# Altium project MaketeEAS.PrjPcb
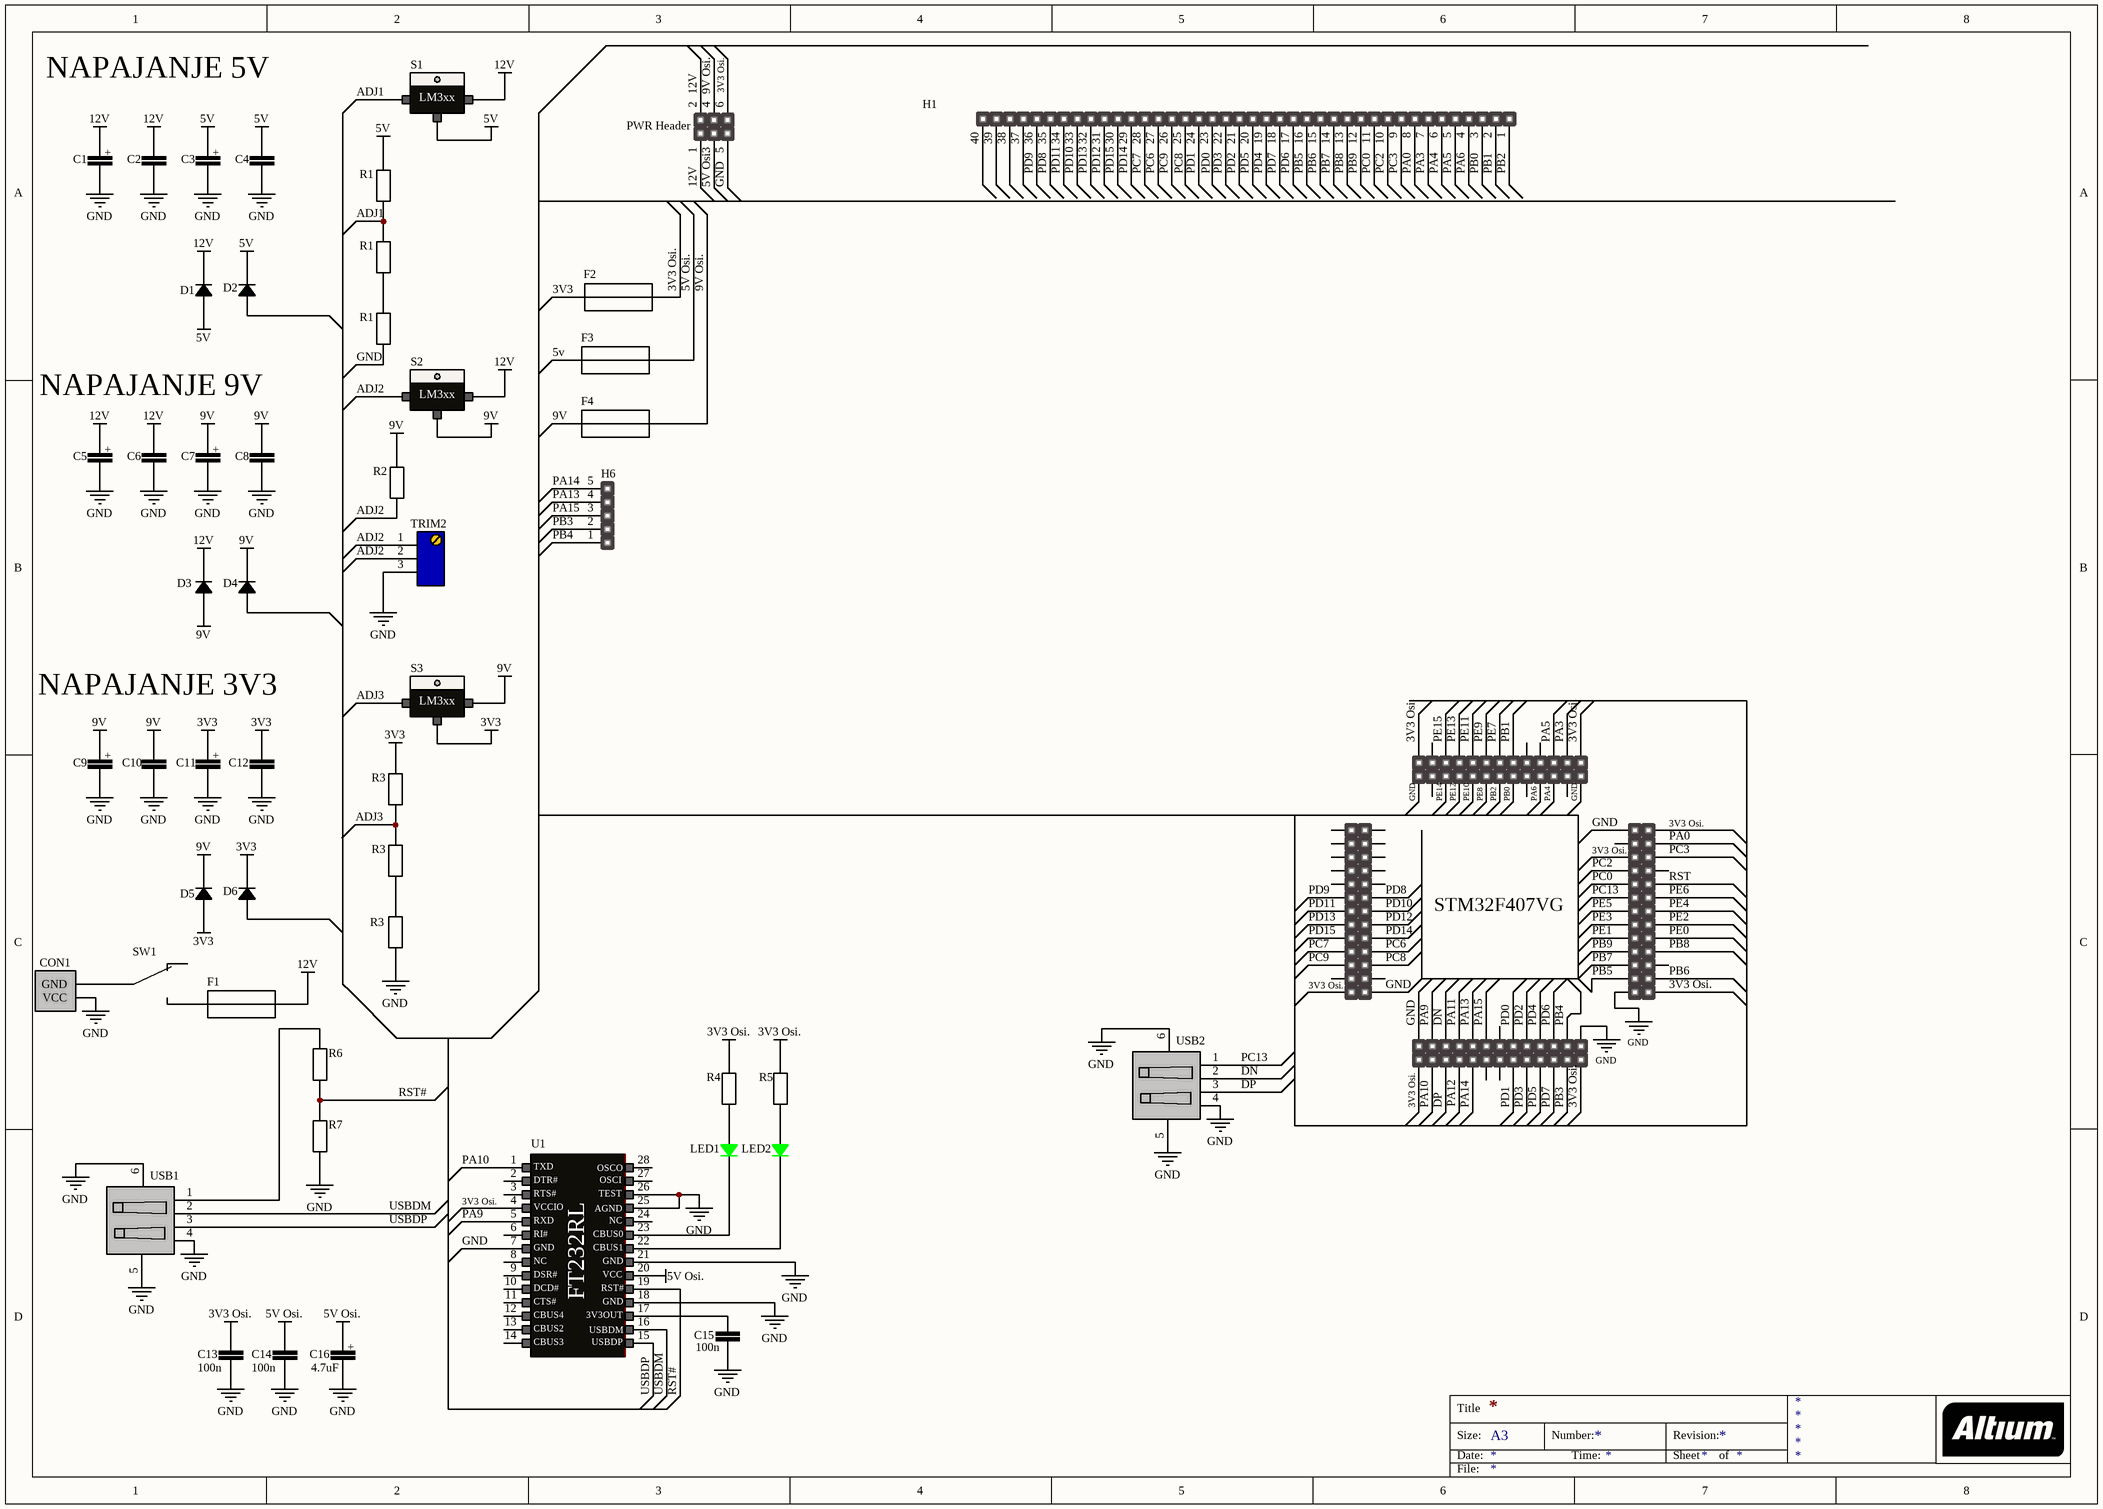
[diagram p0: Sheet1.SchDoc]
2 sheets, 119 parts. Net scope: global (net labels, ports and power ports of the same name join across sheets).
Sheets:
  Sheet1.SchDoc
  Sheet2.SchDoc

## Sheet Sheet1.SchDoc
size A3

### Parts
(Parts that share a designator on the sheet are numbered #1, #2 ... from top to bottom, then left to right.)
C1  (no value)
C2  (no value)  [C1(150milsa)]
C3  (no value)
C4  (no value)  [C1(150milsa)]
C5  (no value)
C6  (no value)  [C1(150milsa)]
C7  (no value)
C8  (no value)  [C1(150milsa)]
C9  (no value)
C10  (no value)  [C1(150milsa)]
C11  (no value)
C12  (no value)  [C1(150milsa)]
C13  100n  [C1(150milsa)]
C14  100n  [C1(150milsa)]
C15  100n  [C1(150milsa)]
C16  4.7uF  [C2(elektrolit)]
CON1  (no value)
D1  (no value)  [D1(300milsa)]
D2  (no value)  [D1(300milsa)]
D3  (no value)  [D1(300milsa)]
D4  (no value)  [D1(300milsa)]
D5  (no value)  [D1(300milsa)]
D6  (no value)  [D1(300milsa)]
F1  (no value)
F2  (no value)
F3  (no value)
F4  (no value)
H1#1  (no value)
H6  (no value)
LED1#1  (no value)  [LED(3mm)]
LED2#1  (no value)  [LED(3mm)]
PWR_Header  (no value)
R1#1  (no value)  [R1(200milsa)]
R1#2  (no value)  [R1(200milsa)]
R1#3  (no value)  [R1(200milsa)]
R2#1  (no value)  [R1(200milsa)]
R3#1  (no value)  [R1(200milsa)]
R3#2  (no value)  [R1(200milsa)]
R3#3  (no value)  [R1(200milsa)]
R4#1  (no value)  [R1(200milsa)]
R5#1  (no value)  [R1(200milsa)]
R6#1  (no value)  [R1(200milsa)]
R7#1  (no value)  [R1(200milsa)]
S1  (no value)  [TO220]
S2  (no value)  [TO220]
S3  (no value)  [TO220]
STM32F407VG  (no value)  [STM32F407VG(ethernet)]
SW1#1  (no value)
TRIM2  (no value)
U1  (no value)  [FT232RL]
USB1  (no value)
USB2  (no value)

### Nets
3V3: C11.1 C12.2 D5.1 D6.2 F2.1 S3.2
3V3 Osi.: C13.1 F2.2 PWR_Header.6 R4#1.2 R5#1.2 STM32F407VG.25 STM32F407VG.27 STM32F407VG.51 STM32F407VG.53 STM32F407VG.74 STM32F407VG.77 STM32F407VG.79 STM32F407VG.103 U1.4
5v: C3.1 C4.2 D1.1 D2.2 F3.1 R1#1.2 S1.2
5V Osi.: C14.1 C16.1 F3.2 PWR_Header.3 U1.20
9V: C7.1 C8.2 C9.1 C10.2 D3.1 D4.2 D5.2 F4.1 R2#1.2 S2.2 S3.3
12V: C1.1 C2.2 C5.1 C6.2 D1.2 D3.2 F1.2 PWR_Header.1 PWR_Header.2 S1.3 S2.3
GND: C1.2 C2.1 C3.2 C4.1 C5.2 C6.1 C7.2 C8.1 C9.2 C10.1 C11.2 C12.1 C13.2 C14.2 C15.2 C16.2 CON1.1(VCC) PWR_Header.5 R1#3.1 R3#3.2 R7#1.2 STM32F407VG.26 STM32F407VG.28 STM32F407VG.52 STM32F407VG.54 STM32F407VG.78 STM32F407VG.80 STM32F407VG.104 TRIM2.3 U1.7 U1.18 U1.21 U1.25 U1.26 USB1.4 USB1.5 USB1.6 USB2.4 USB2.5 USB2.6
9V Osi.: F4.2 PWR_Header.4
ADJ1: R1#1.1 R1#2.2 S1.1
ADJ2: R2#1.1 S2.1 TRIM2.1 TRIM2.2
ADJ3: R3#1.1 R3#2.2 S3.1
DN: STM32F407VG.32 USB2.2
DP: STM32F407VG.31 USB2.3
PA0: H1#1.8 STM32F407VG.75
PA3: H1#1.7 STM32F407VG.81
PA4: H1#1.6 STM32F407VG.84
PA5: H1#1.5 STM32F407VG.83
PA6: H1#1.4 STM32F407VG.86
PA9: STM32F407VG.30 U1.5
PA10: STM32F407VG.29 U1.1
PA11: STM32F407VG.34
PA12: STM32F407VG.33
PA13: H6.4 STM32F407VG.36
PA14: H6.5 STM32F407VG.35
PA15: H6.3 STM32F407VG.38
PB0: H1#1.3 STM32F407VG.90
PB1: H1#1.2 STM32F407VG.89
PB2: H1#1.1 STM32F407VG.92
PB3: H6.2 STM32F407VG.49
PB4: H6.1 STM32F407VG.50
PB5: H1#1.16 STM32F407VG.56
PB6: H1#1.15 STM32F407VG.55
PB7: H1#1.14 STM32F407VG.58
PB8: H1#1.13 STM32F407VG.59
PB9: H1#1.12 STM32F407VG.60
PC0: H1#1.11 STM32F407VG.70
PC2: H1#1.10 STM32F407VG.72
PC3: H1#1.9 STM32F407VG.73
PC6: H1#1.27 STM32F407VG.20
PC7: H1#1.28 STM32F407VG.19
PC8: STM32F407VG.22
PC9: H1#1.26 STM32F407VG.21
PC13: STM32F407VG.68 USB2.1
PD0: STM32F407VG.42
PD1: H1#1.24 STM32F407VG.41
PD2: H1#1.21 STM32F407VG.44
PD3: H1#1.22 STM32F407VG.43
PD4: H1#1.19 STM32F407VG.46
PD5: H1#1.20 STM32F407VG.45
PD6: H1#1.17 STM32F407VG.48
PD7: H1#1.18 STM32F407VG.47
PD8: H1#1.35 STM32F407VG.12
PD9: H1#1.36 STM32F407VG.11
PD10: H1#1.33 STM32F407VG.14
PD11: H1#1.34 STM32F407VG.13
PD12: H1#1.31 STM32F407VG.16
PD13: H1#1.32 STM32F407VG.15
PD14: H1#1.29 STM32F407VG.18
PD15: H1#1.30 STM32F407VG.17
PE0: STM32F407VG.61
PE1: STM32F407VG.62
PE2: STM32F407VG.63
PE3: STM32F407VG.64
PE4: STM32F407VG.65
PE5: STM32F407VG.66
PE6: STM32F407VG.67
PE7: STM32F407VG.91
PE8: STM32F407VG.94
PE9: STM32F407VG.93
PE10: STM32F407VG.96
PE11: STM32F407VG.95
PE12: STM32F407VG.98
PE13: STM32F407VG.97
PE14: STM32F407VG.100
PE15: STM32F407VG.99
RST: STM32F407VG.69
RST#: R6#1.2 R7#1.1 U1.19
USBDM: U1.16 USB1.2
USBDP: U1.15 USB1.3
NetC15_1: C15.1 U1.17
NetCON1_2: CON1.2(GND) SW1#1.2
NetF1_1: F1.1 SW1#1.3
NetLED1#1_1: LED1#1.1 R4#1.1
NetLED1#1_2: LED1#1.2 U1.23
NetLED2#1_1: LED2#1.1 R5#1.1
NetLED2#1_2: LED2#1.2 U1.22
NetR1#2_1: R1#2.1 R1#3.2
NetR3#2_1: R3#2.1 R3#3.1
NetR6#1_1: R6#1.1 USB1.1

Not connected (* = marked no-connect by the designer): D2 1; D4 1; D6 1; H1#1 23 25 37 38 39 40; R3#1 2; STM32F407VG 1 2 3 4 5 6 7 8 9 10 23 24 37 39 40 57 71 76 82 85 87 88 101 102; SW1#1 1; U1 2 3 6 8 9 10 11 12 13 14 24 27 28

### Notes on the sheet
- NAPAJANJE 5V
- NAPAJANJE 9V
- NAPAJANJE 3V3
- Labels drawn without touching a wire or pin: 3V3, PC8, PD0
- Title
- Size:
- Date:
- A3
- Number:
- Time:
- Revision:
- Sheet
- of
- File:
- (in symbol C2) +
- (in symbol FT232) TXD; OSCO; DTR#; OSCI; RTS#; TEST; VCCIO; AGND; RXD; NC; RI#; CBUS0; GND; CBUS1; DSR#; VCC; DCD#; RST#; FT232RL; CTS#; CBUS4; 3V3OUT; CBUS2; USBDM; CBUS3; USBDP
- (in symbol LM317/LM350) LM3xx

### Library data of the parts
C1 C3 C5 C7 C9 C11 C16 = C2
C2 C4 C6 C8 C10 C12-C15 = C1
CON1 = PWR_CON
D1-D6 = D1
F1-F4 = FUSE
H1#1 = HEADER1X40
H6 = Header1x5
LED1#1 LED2#1 = LED
PWR_Header = Header2x3
R1#1-R1#3 R2#1 R3#1-R3#3 R4#1 R5#1 R6#1 R7#1 = R1
S1-S3 = LM317/LM350
STM32F407VG = STM32F407
SW1#1 = SW
TRIM2 = TRIM
U1 = FT232
USB1 USB2 = USB type B

## Sheet Sheet2.SchDoc
size A3
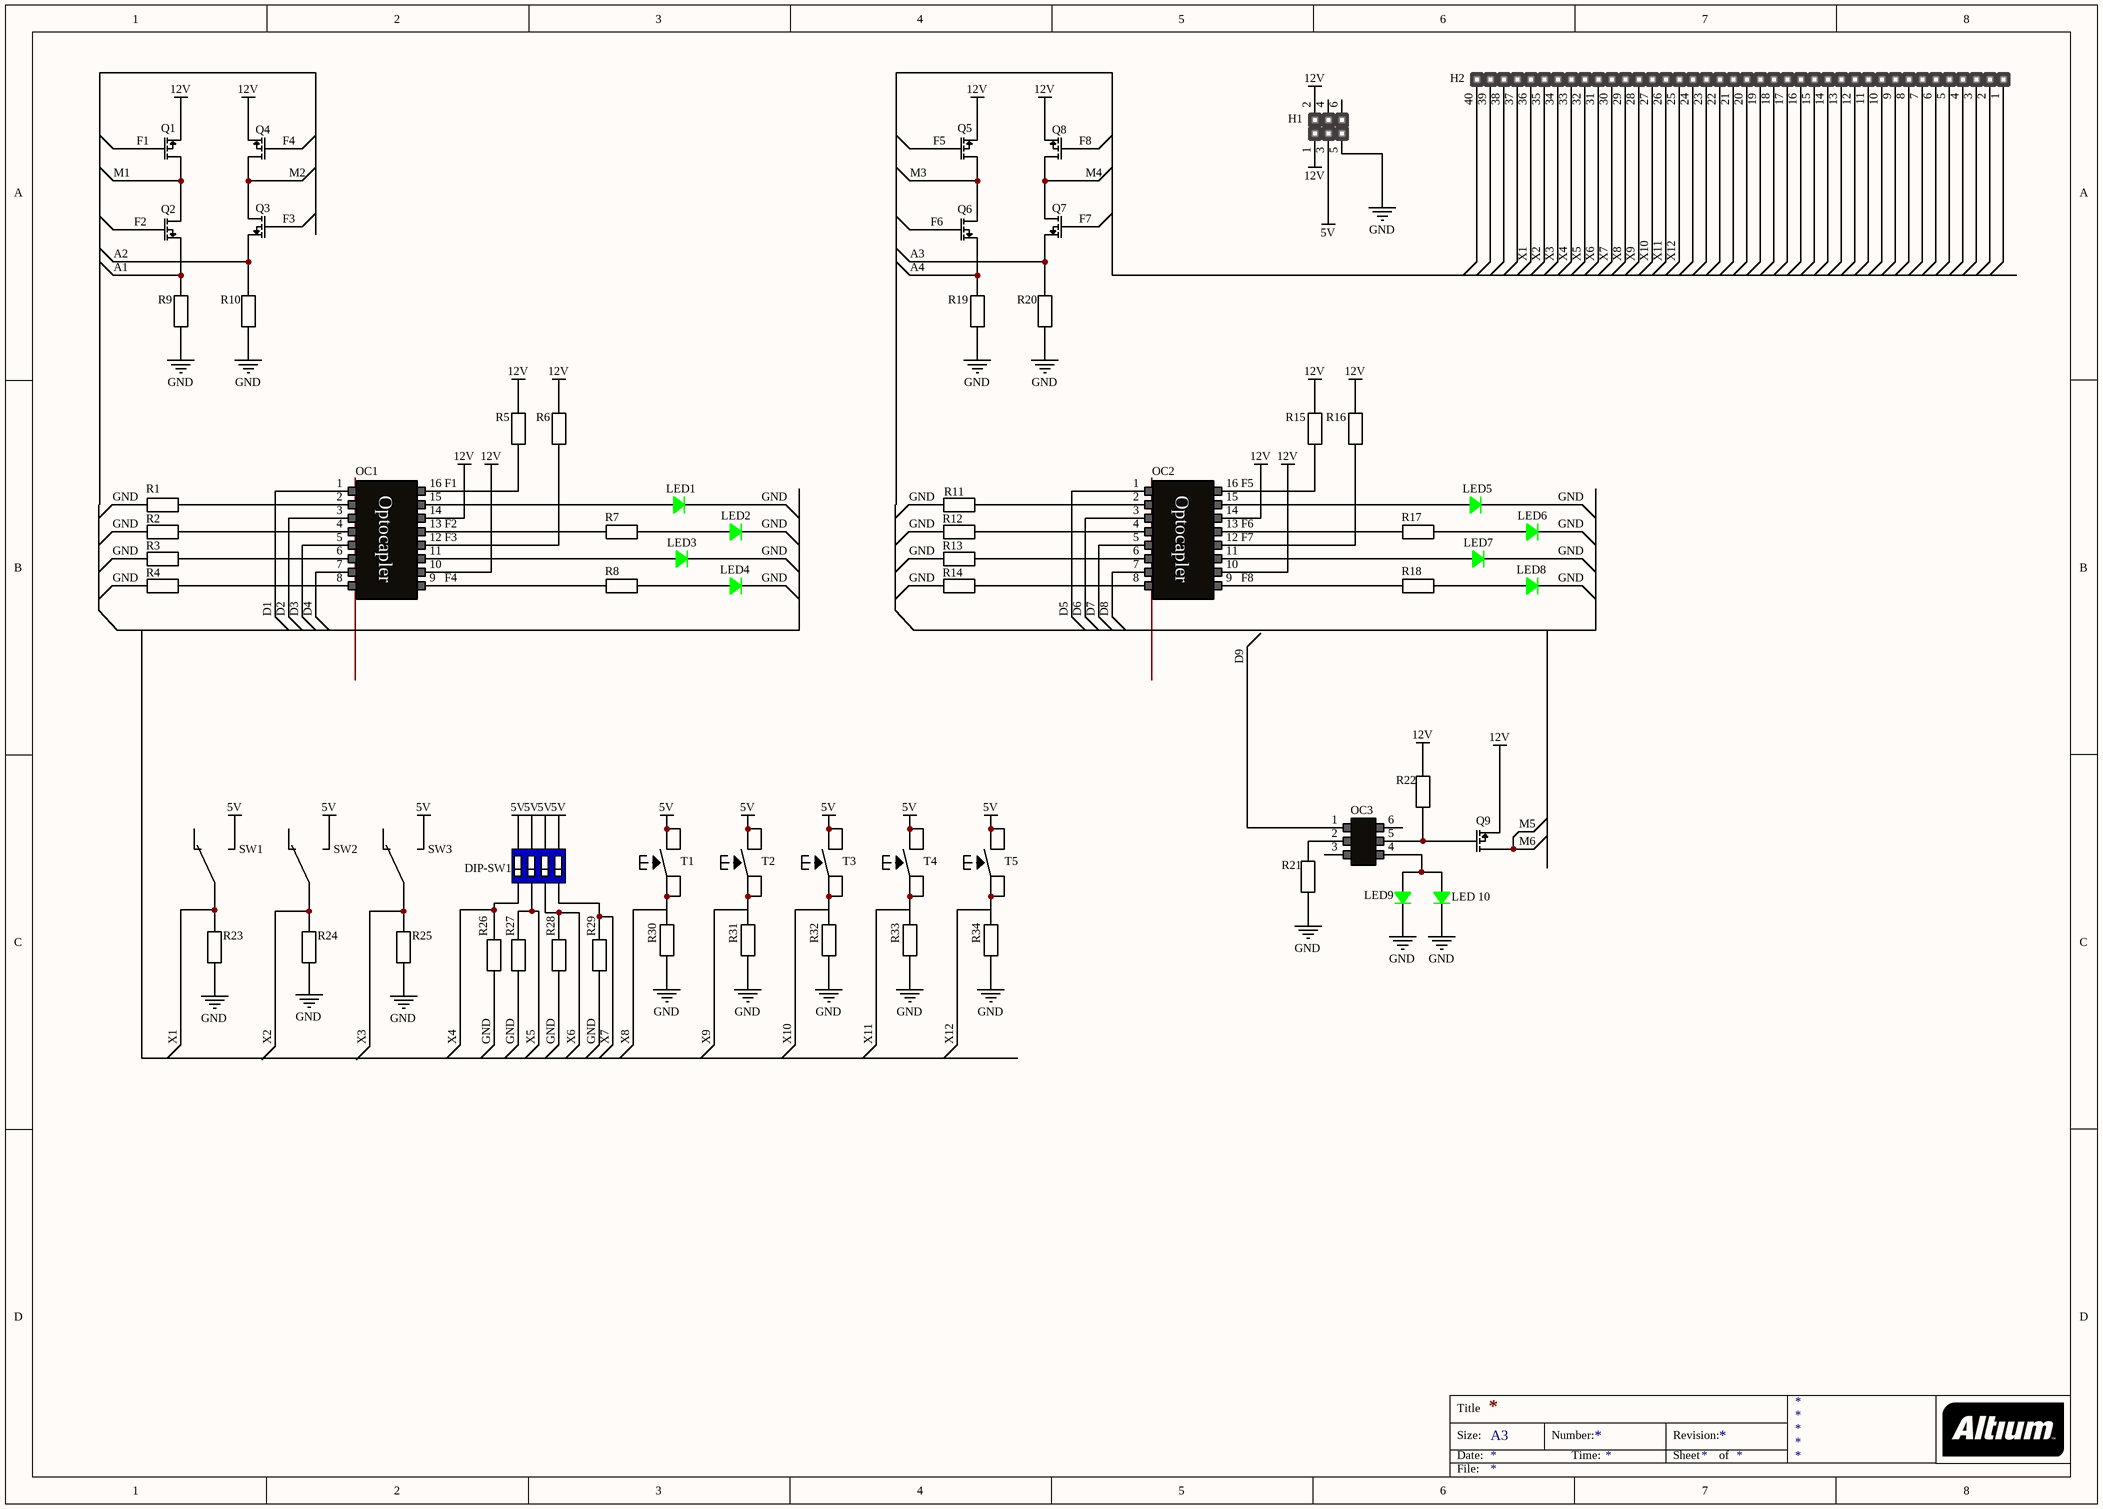
[diagram p1: Sheet2.SchDoc]

### Parts
(Parts that share a designator on the sheet are numbered #1, #2 ... from top to bottom, then left to right.)
DIP-SW1  (no value)
H1#2  (no value)
H2  (no value)
LED1#2  (no value)  [LED(3mm)]
LED2#2  (no value)  [LED(3mm)]
LED3  (no value)  [LED(3mm)]
LED4  (no value)  [LED(3mm)]
LED5  (no value)  [LED(3mm)]
LED6  (no value)  [LED(3mm)]
LED7  (no value)  [LED(3mm)]
LED8  (no value)  [LED(3mm)]
LED9  (no value)  [LED(3mm)]
LED_10  (no value)  [LED(3mm)]
OC1  (no value)
OC2  (no value)
OC3  (no value)
Q1  (no value)
Q2  (no value)
Q3  (no value)
Q4  (no value)
Q5  (no value)
Q6  (no value)
Q7  (no value)
Q8  (no value)
Q9  (no value)
R1#4  (no value)  [R1(200milsa)]
R2#2  (no value)  [R1(200milsa)]
R3#4  (no value)  [R1(200milsa)]
R4#2  (no value)  [R1(200milsa)]
R5#2  (no value)  [R1(200milsa)]
R6#2  (no value)  [R1(200milsa)]
R7#2  (no value)  [R1(200milsa)]
R8  (no value)  [R1(200milsa)]
R9  (no value)  [R1(200milsa)]
R10  (no value)  [R1(200milsa)]
R11  (no value)  [R1(200milsa)]
R12  (no value)  [R1(200milsa)]
R13  (no value)  [R1(200milsa)]
R14  (no value)  [R1(200milsa)]
R15  (no value)  [R1(200milsa)]
R16  (no value)  [R1(200milsa)]
R17  (no value)  [R1(200milsa)]
R18  (no value)  [R1(200milsa)]
R19  (no value)  [R1(200milsa)]
R20  (no value)  [R1(200milsa)]
R21  (no value)  [R1(200milsa)]
R22  (no value)  [R1(200milsa)]
R23  (no value)  [R1(200milsa)]
R24  (no value)  [R1(200milsa)]
R25  (no value)  [R1(200milsa)]
R26  (no value)  [R1(200milsa)]
R27  (no value)  [R1(200milsa)]
R28  (no value)  [R1(200milsa)]
R29  (no value)  [R1(200milsa)]
R30  (no value)  [R1(200milsa)]
R31  (no value)  [R1(200milsa)]
R32  (no value)  [R1(200milsa)]
R33  (no value)  [R1(200milsa)]
R34  (no value)  [R1(200milsa)]
SW1#2  (no value)
SW2  (no value)
SW3  (no value)
T1  (no value)
T2  (no value)
T3  (no value)
T4  (no value)
T5  (no value)

### Nets
5v: DIP-SW1.5 DIP-SW1.6 DIP-SW1.7 DIP-SW1.8 H1#2.3 SW1#2.3 SW2.3 SW3.3 T1.1 T1.2 T2.1 T2.2 T3.1 T3.2 T4.1 T4.2 T5.1 T5.2
12V: H1#2.1 H1#2.2 OC1.10 OC1.14 OC2.10 OC2.14 Q1.2 Q4.3 Q5.2 Q8.3 Q9.2 R5#2.2 R6#2.2 R15.2 R16.2 R22.1
GND: H1#2.5 LED1#2.2 LED2#2.2 LED3.2 LED4.2 LED5.2 LED6.2 LED7.2 LED8.2 LED9.2 LED_10.2 R1#4.2 R2#2.1 R3#4.1 R4#2.1 R9.1 R10.1 R11.1 R12.1 R13.1 R14.1 R19.1 R20.1 R21.2 R23.1 R25.1 R26.1 R27.1 R28.1 R29.1 R30.1 R31.1 R32.1 R33.1 R34.1
A1: Q2.3 R9.2
A2: Q3.2 R10.2
A3: Q7.2 R20.2
A4: Q6.3 R19.2
D1: OC1.1
D2: OC1.3
D3: OC1.5
D4: OC1.7
D5: OC2.1
D6: OC2.3
D7: OC2.5
D8: OC2.7
D9: OC3.1
F1: OC1.16 Q1.1 R5#2.1
F2: OC1.13 Q2.1 R7#2.1
F3: OC1.12 Q3.1 R6#2.1
F4: OC1.9 Q4.1 R8.1
F5: OC2.16 Q5.1 R15.1
F6: OC2.13 Q6.1 R17.1
F7: OC2.12 Q7.1 R16.1
F8: OC2.9 Q8.1 R18.1
M1: Q1.3 Q2.2
M2: Q3.3 Q4.2
M3: Q5.3 Q6.2
M4: Q7.3 Q8.2
M5: Q9.3  [also labelled M6]
X1: H2.36 R23.2 SW1#2.2
X2: H2.35 R24.2 SW2.2
X3: H2.34 R25.2 SW3.2
X4: DIP-SW1.1 H2.33 R26.2
X5: DIP-SW1.2 H2.32 R27.2
X6: DIP-SW1.3 H2.31 R28.2
X7: DIP-SW1.4 H2.30 R29.2
X8: H2.29
X9: H2.28
X10: H2.27
X11: H2.26
X12: H2.25
NetLED1#2_1: LED1#2.1 OC1.15
NetLED2#2_1: LED2#2.1 R7#2.2
NetLED3_1: LED3.1 OC1.11
NetLED4_1: LED4.1 R8.2
NetLED5_1: LED5.1 OC2.15
NetLED6_1: LED6.1 R17.2
NetLED7_1: LED7.1 OC2.11
NetLED8_1: LED8.1 R18.2
NetLED9_1: LED9.1 LED_10.1 OC3.4
NetOC1_2: OC1.2 R1#4.1
NetOC1_4: OC1.4 R2#2.2
NetOC1_6: OC1.6 R3#4.2
NetOC1_8: OC1.8 R4#2.2
NetOC2_2: OC2.2 R11.2
NetOC2_4: OC2.4 R12.2
NetOC2_6: OC2.6 R13.2
NetOC2_8: OC2.8 R14.2
NetOC3_2: OC3.2 R21.1
NetOC3_5: OC3.5 Q9.1 R22.2
NetR30_2: R30.2 T1.3 T1.4
NetR31_2: R31.2 T2.3 T2.4
NetR32_2: R32.2 T3.3 T3.4
NetR33_2: R33.2 T4.3 T4.4
NetR34_2: R34.2 T5.3 T5.4

Not connected (* = marked no-connect by the designer): H1#2 4 6; H2 1 2 3 4 5 6 7 8 9 10 11 12 13 14 15 16 17 18 19 20 21 22 23 24 37 38 39 40; OC3 3 6; R24 1; SW1#2 1; SW2 1; SW3 1

### Notes on the sheet
- Labels drawn without touching a wire or pin: GND
- Title
- Size:
- Date:
- A3
- Number:
- Time:
- Revision:
- Sheet
- of
- File:
- (in symbol DIP16) Optocapler

### Library data of the parts
DIP-SW1 = DIP-SW4
H1#2 = Header2x3
H2 = HEADER1X40
LED1#2 LED2#2 LED3-LED9 LED_10 = LED
OC1 OC2 = DIP16
OC3 = DIP6
Q1 Q3 Q5 Q7 Q9 = FET
Q2 Q4 Q6 Q8 = FET2
R1#4 R2#2 R3#4 R4#2 R5#2 R6#2 R7#2 R8-R34 = R1
SW1#2 SW2 SW3 = SW
T1-T5 = Taster

## Nets that join several sheets
5v: Sheet1 (7 pins), Sheet2 (18 pins)
12V: Sheet1 (11 pins), Sheet2 (16 pins)
GND: Sheet1 (40 pins), Sheet2 (35 pins)